# Altium schematic sheet cps_tc_pishield.SchDoc
size A4
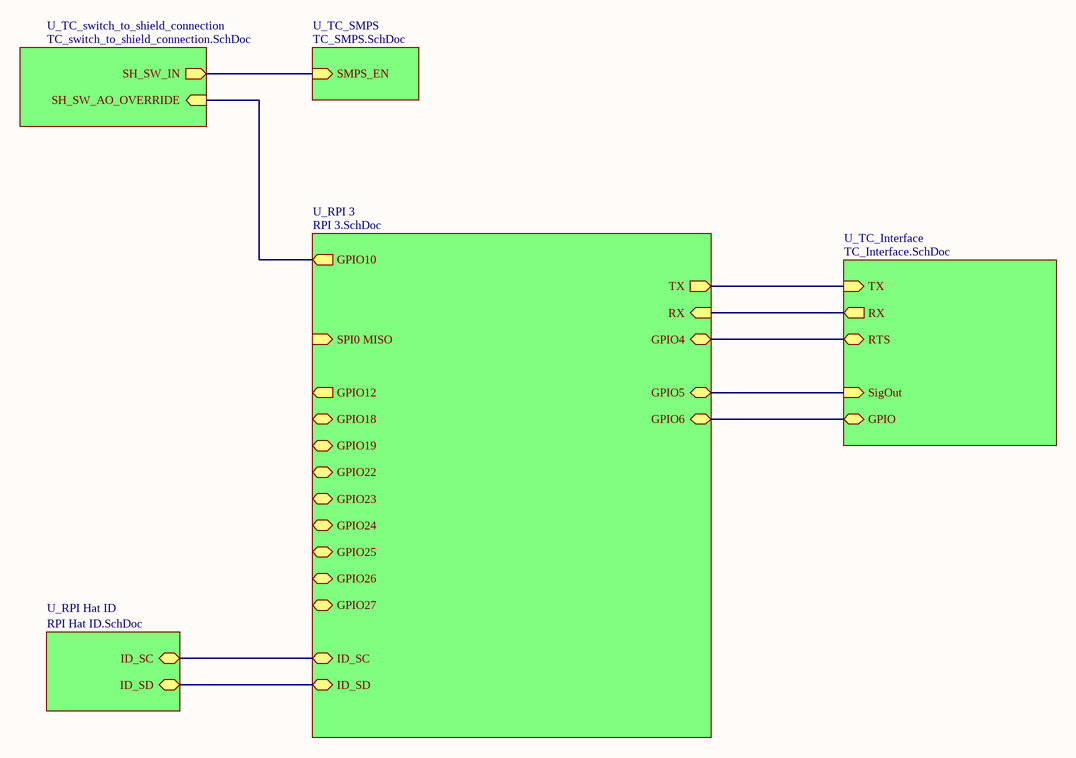
[diagram p0: cps_tc_pishield.SchDoc]

## Sub-sheets
U_RPI 3 = RPI 3.SchDoc: GPIO4 (bidir), GPIO27 (bidir), GPIO22 (bidir), GPIO26 (bidir), GPIO19 (bidir), GPIO6 (bidir), GPIO5 (bidir), RX (in), TX (out), GPIO24 (bidir), GPIO25 (bidir), GPIO12 (out), GPIO18 (bidir), GPIO23 (bidir), ID_SC (bidir), ID_SD (bidir), SPI0 MISO (in), GPIO10 (out)
U_RPI Hat ID = RPI Hat ID.SchDoc: ID_SC (bidir), ID_SD (bidir)
U_TC_Interface = TC_Interface.SchDoc: GPIO (bidir), RTS (bidir), TX (in), RX (out), SigOut (in)
U_TC_SMPS = TC_SMPS.SchDoc: SMPS_EN (in)
U_TC_switch_to_shield_connection = TC_switch_to_shield_connection.SchDoc: SH_SW_AO_OVERRIDE (in), SH_SW_IN (out)

## Nets
(unnamed): sheet U_RPI 3/GPIO4, sheet U_TC_Interface/RTS
(unnamed): sheet U_RPI 3/GPIO6, sheet U_TC_Interface/GPIO
(unnamed): sheet U_RPI 3/GPIO5, sheet U_TC_Interface/SigOut
(unnamed): sheet U_RPI 3/RX, sheet U_TC_Interface/RX
(unnamed): sheet U_RPI 3/TX, sheet U_TC_Interface/TX
(unnamed): sheet U_RPI 3/ID_SC, sheet U_RPI Hat ID/ID_SC
(unnamed): sheet U_RPI 3/ID_SD, sheet U_RPI Hat ID/ID_SD
(unnamed): sheet U_RPI 3/GPIO10, sheet U_TC_switch_to_shield_connection/SH_SW_AO_OVERRIDE
(unnamed): sheet U_TC_SMPS/SMPS_EN, sheet U_TC_switch_to_shield_connection/SH_SW_IN